# EAGLE design rpi-can-rs485 (EAGLE 6.2)
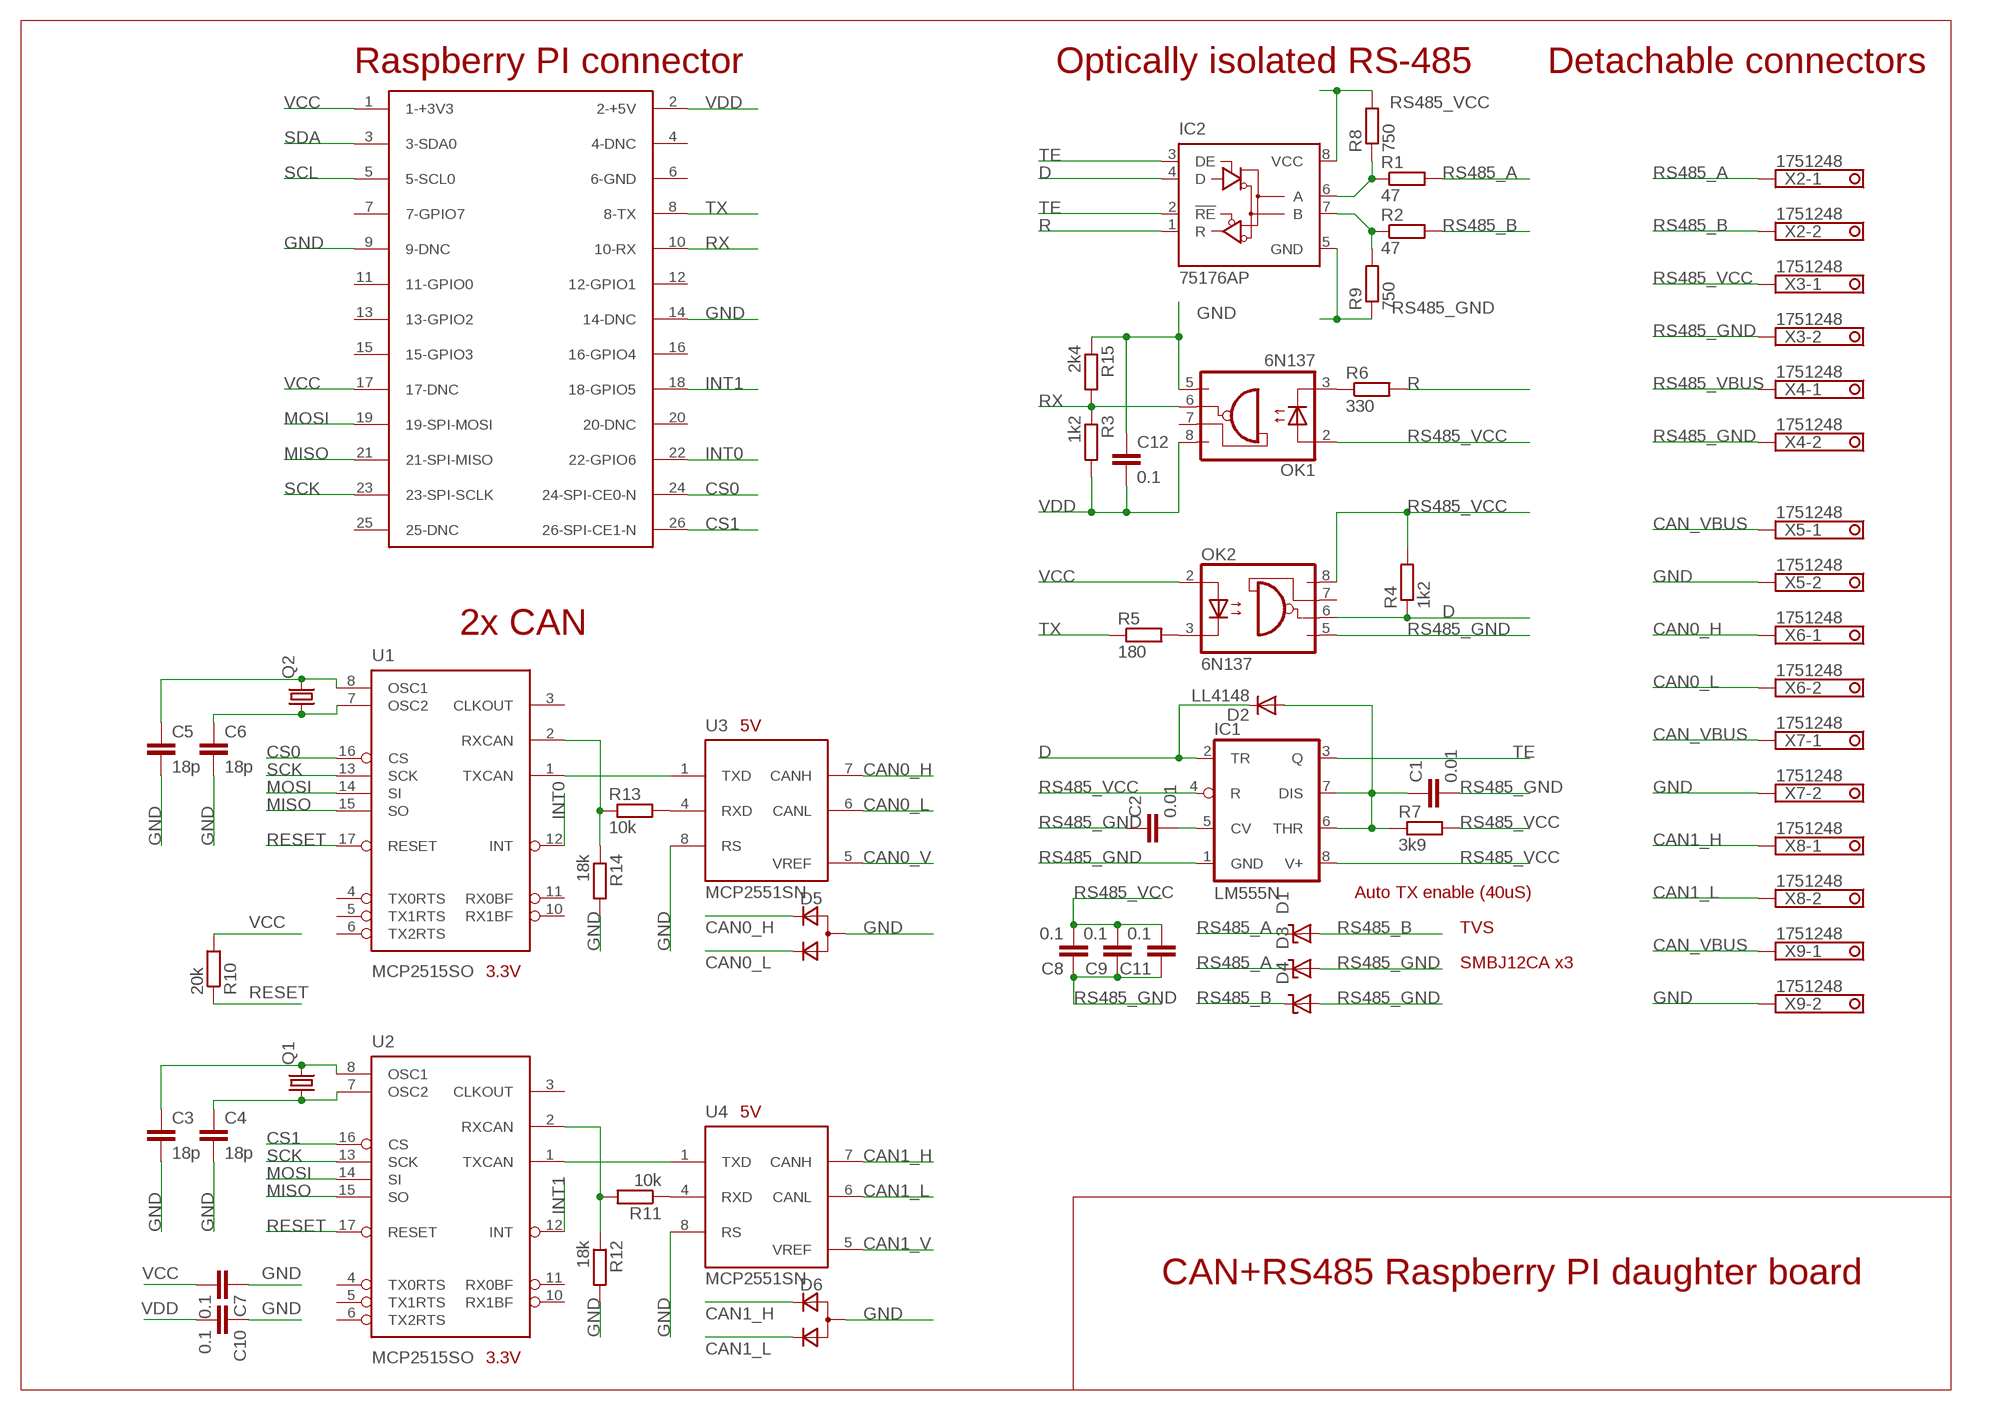
[diagram p0: schematic, sheet 1]

## Parts
C1  0.01  C-EUC0805  [C0805]
C2  0.01  C-EUC0805  [C0805]
C3  18p  C-EUC0805  [C0805]
C4  18p  C-EUC0805  [C0805]
C5  18p  C-EUC0805  [C0805]
C6  18p  C-EUC0805  [C0805]
C7  0.1  C-EUC1206  [C1206]
C8  0.1  C-EUC0805  [C0805]
C9  0.1  C-EUC0805  [C0805]
C10  0.1  C-EUC0805  [C0805]
C11  0.1  C-EUC1206  [C1206]
C12  0.1  C-EUC1206  [C1206]
D1  SUPPRESSOR-SMBJ  [SMBJ]
D2  LL4148  DIODE-SOD80C  [SOD80C]
D3  SUPPRESSOR-SMBJ  [SMBJ]
D4  SUPPRESSOR-SMBJ  [SMBJ]
D5  D_2CSOT323  [SOT323]
D6  D_2CSOT323  [SOT323]
IC1  LM555N  [DIL08]
IC2  75176AP  [DIL08]
OK1  6N137  [DIL08]
OK2  6N137  [DIL08]
Q1  CRYSTALHC49S  [HC49/S]
Q2  CRYSTALHC49S  [HC49/S]
R1  47  R-EU_R1206  [R1206]
R2  47  R-EU_R1206  [R1206]
R3  1k2  R-EU_R0805  [R0805]
R4  1k2  R-EU_R0805  [R0805]
R5  180  R-EU_R0805  [R0805]
R6  330  R-EU_R0805  [R0805]
R7  3k9  R-EU_R0805  [R0805]
R8  750  R-EU_R1206  [R1206]
R9  750  R-EU_R1206  [R1206]
R10  20k  R-EU_R0805  [R0805]
R11  10k  R-EU_R0805  [R0805]
R12  18k  R-EU_R0805  [R0805]
R13  10k  R-EU_R0805  [R0805]
R14  18k  R-EU_R0805  [R0805]
R15  2k4  R-EU_R0805  [R0805]
U1  MCP2515SO  MCP2510SO  [SO-18W]
U2  MCP2515SO  MCP2510SO  [SO-18W]
U3  MCP2551SN  [SO-08]
U4  MCP2551SN  [SO-08]
U$1  RASPBERRY-PI  [RASPBERRY-PI]
X2  1751248  [1751248]
X3  1751248  [1751248]
X4  1751248  [1751248]
X5  1751248  [1751248]
X6  1751248  [1751248]
X7  1751248  [1751248]
X8  1751248  [1751248]
X9  1751248  [1751248]

## Nets
CAN0_H: D5.2(C1) U3.7(CANH) X6.1
CAN0_L: D5.3(C2) U3.6(CANL) X6.2
CAN0_TX: U1.1(TXCAN) U3.1(TXD)
CAN0_V: U3.5(VREF)
CAN1_H: D6.2(C1) U4.7(CANH) X8.1
CAN1_L: D6.3(C2) U4.6(CANL) X8.2
CAN1_TX: U2.1(TXCAN) U4.1(TXD)
CAN1_V: U4.5(VREF)
CAN_VBUS: X5.1 X7.1 X9.1
CS0: U1.16(CS) U$1.24(24-SPI-CE0-N)
CS1: U2.16(CS) U$1.26(26-SPI-CE1-N)
D: D2.C IC1.2(TR) IC2.4(D) OK2.6(VO) R4.1
GND: C3.2 C4.2 C5.2 C6.2 C7.1 C10.1 C12.1 D5.1(A) D6.1(A) OK1.5(GND) R12.2 R14.2 R15.1 U3.8(RS) U4.8(RS) U$1.9(9-DNC) U$1.14(14-DNC) X5.2 X7.2 X9.2
INT0: U1.12(INT) U$1.22(22-GPIO6)
INT1: U2.12(INT) U$1.18(18-GPIO5)
MISO: U1.15(SO) U2.15(SO) U$1.21(21-SPI-MISO)
MOSI: U1.14(SI) U2.14(SI) U$1.19(19-SPI-MOSI)
N$1: C6.1 Q2.1 U1.7(OSC2)
N$2: C1.1 D2.A IC1.6(THR) IC1.7(DIS) R7.1
N$3: IC2.7(B) R2.1 R9.2
N$4: IC2.6(A) R1.1 R8.1
N$5: C2.2 IC1.5(CV)
N$6: C5.1 Q2.2 U1.8(OSC1)
N$7: OK2.3(C) R5.2
N$8: OK1.3(C) R6.1
N$9: R11.1 U4.4(RXD)
N$10: R13.2 U3.4(RXD)
N$11: C3.1 Q1.2 U2.8(OSC1)
N$12: C4.1 Q1.1 U2.7(OSC2)
N$13: R13.1 R14.1 U1.2(RXCAN)
N$14: R11.2 R12.1 U2.2(RXCAN)
R: IC2.1(R) R6.2
RESET: R10.1 U1.17(RESET) U2.17(RESET)
RS485_A: D1.C D3.C R1.2 X2.1
RS485_B: D1.A D4.C R2.2 X2.2
RS485_GND: C1.2 C2.1 C8.1 C9.1 C11.1 D3.A D4.A IC1.1(GND) IC2.5(GND) OK2.5(GND) R9.1 X3.2 X4.2
RS485_VBUS: X4.1
RS485_VCC: C8.2 C9.2 C11.2 IC1.4(R) IC1.8(V+) IC2.8(VCC) OK1.2(A) OK2.8(VCC) R4.2 R7.2 R8.2 X3.1
RX: OK1.6(VO) R3.1 R15.2 U$1.10(10-RX)
SCK: U1.13(SCK) U2.13(SCK) U$1.23(23-SPI-SCLK)
SCL: U$1.5(5-SCL0)
SDA: U$1.3(3-SDA0)
TE: IC1.3(Q) IC2.2(!RE) IC2.3(DE)
TX: R5.1 U$1.8(8-TX)
VCC: C7.2 OK2.2(A) R10.2 U$1.1(1-+3V3) U$1.17(17-DNC)
VDD: C10.2 C12.2 OK1.8(VCC) R3.2 U$1.2(2-+5V)
Unconnected: OK1.7(VE) OK2.7(VE) U1.3(CLKOUT) U1.4(TX0RTS) U1.5(TX1RTS) U1.6(TX2RTS) U1.10(RX1BF) U1.11(RX0BF) U2.3(CLKOUT) U2.4(TX0RTS) U2.5(TX1RTS) U2.6(TX2RTS) U2.10(RX1BF) U2.11(RX0BF) U$1.4(4-DNC) U$1.6(6-GND) U$1.7(7-GPIO7) U$1.11(11-GPIO0) U$1.12(12-GPIO1) U$1.13(13-GPIO2) U$1.15(15-GPIO3) U$1.16(16-GPIO4) U$1.20(20-DNC) U$1.25(25-DNC)

## Notes on the sheet
- Raspberry PI connector | Optically isolated RS-485 | Detachable connectors
- 2x CAN
- 5V
- Auto TX enable (40uS)
- TVS
- SMBJ12CA x3
- 3.3V
- 5V
- CAN+RS485 Raspberry PI daughter board
- 3.3V

## Power pins joined to a net without a drawn wire
GND: U1.9(VSS) U2.9(VSS) U3.2(VSS) U4.2(VSS)
VCC: U1.18(VDD) U2.18(VDD)
VDD: U3.3(VDD) U4.3(VDD)

## Library data of the parts
C1-C12 = rcl:C-EU: CAPACITOR, European symbol
D1 D3 D4 = diode:SUPPRESSOR-: Suppressor diode
D2 = diode:DIODE-: DIODE
D5 D6 = zetex:D_2C: Dual DIODE; OC_FARNELL: unknown; OC_NEWARK: unknown
IC1 = linear:*555: TIMER
IC2 = 751xx:75176A: DIFFERENTIAL BUS TRANSCEIVER Source: http://focus.ti.com/lit/ds/symlink/sn75176a.pdf
OK1 OK2 = optocoupler:6N137: MOTOROLA OPTO COUPLER; MPN: 6N137; OC_FARNELL: 1328376; OC_NEWARK: 52M1895
Q1 Q2 = crystal:CRYSTAL: CRYSTAL; OC_FARNELL: 1667008; OC_NEWARK: unknown
R1-R15 = rcl:R-EU_: RESISTOR, European symbol
U1 U2 = my-microchip-can:MCP2510
U3 U4 = my-microchip-can:MCP2551: High Speed CAN tranceiver
U$1 = RaspberryPi:RASPBERRY-PI: Raspberry Pi Board <http://www.raspberrypi.org/> Jacques Lagnel V1.0 (beta) 2012 Board dimension: Forum 3D model <http://www.raspberrypi.org/forum/general-discussion/mechanical-profile-3d-models?value=3d%20model&type=1&include=1&search=1&ret=all> The GPIO Connector (P1): http://elinux.org/RPi_Low-level_peripherals
X2-X9 = con-phoenix-350:1751248: MKDS 1/ 2-3,5 Printklemme Nennstrom: 10 A Bemessungsspannung: 160 V Raster: 3,5 mm Polzahl: 2 Montageart: Löten Anschlussart: Schraubanschluss Anschlussrichtung vom Leiter zur Platine: 0° Source: http://eshop.phoenixcontact.com .. 1751248.pdf; OC_FARNELL: unknown; OC_NEWARK: unknown

## Board
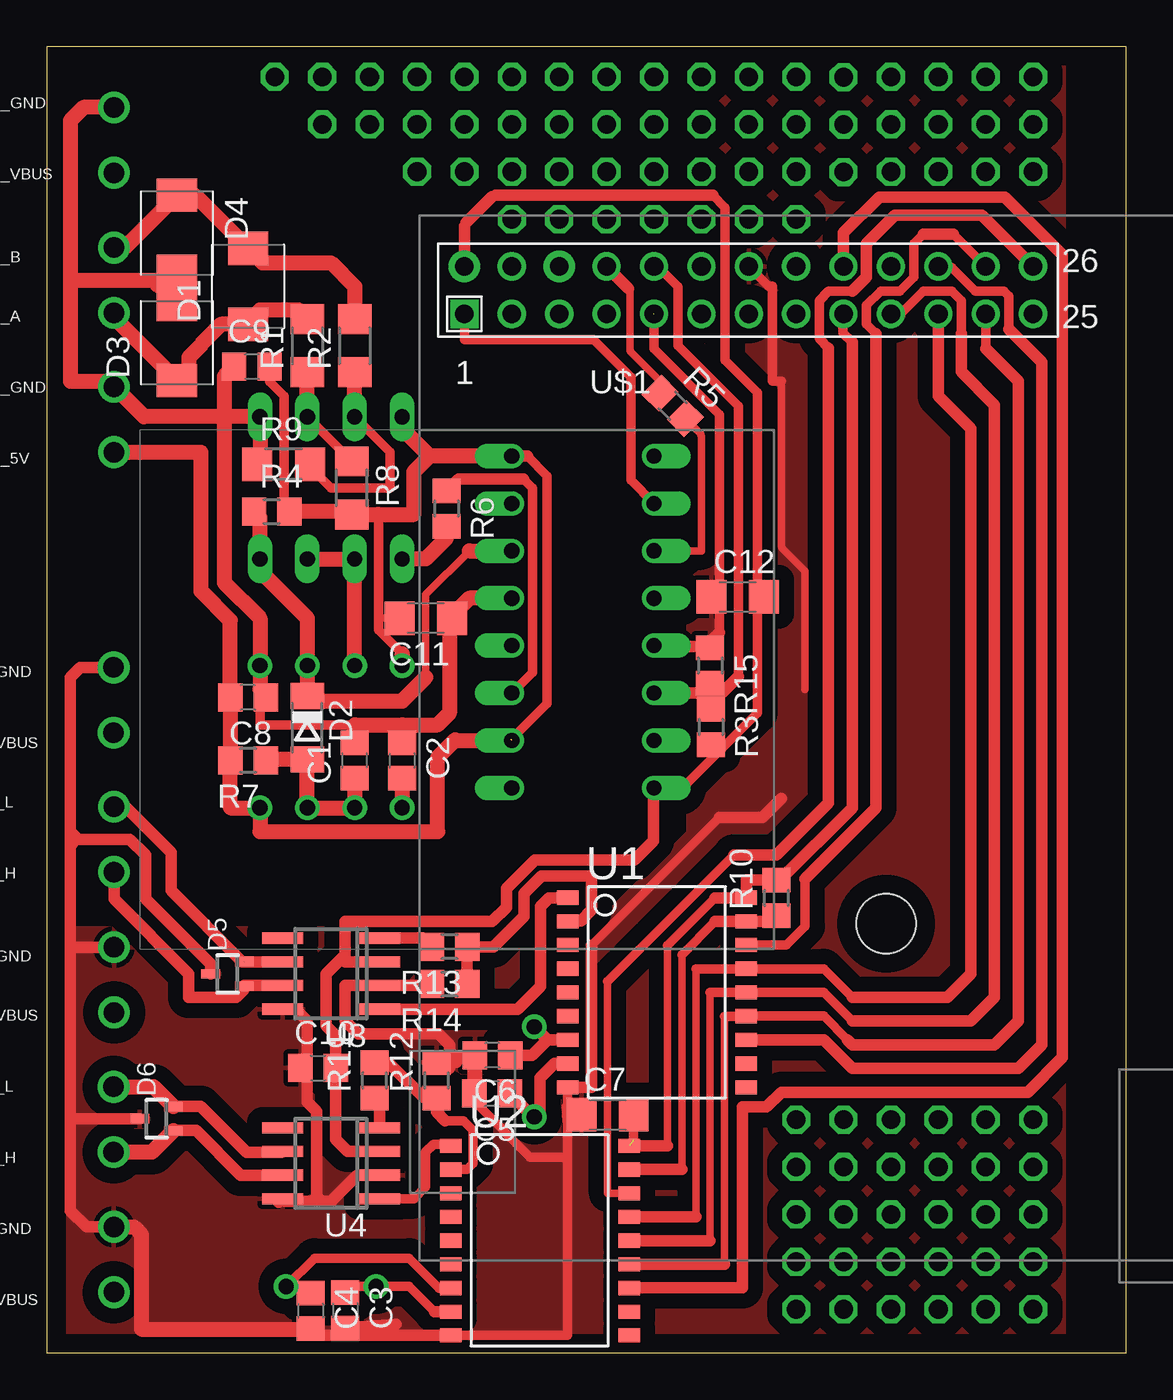
[diagram p1: board, top side]
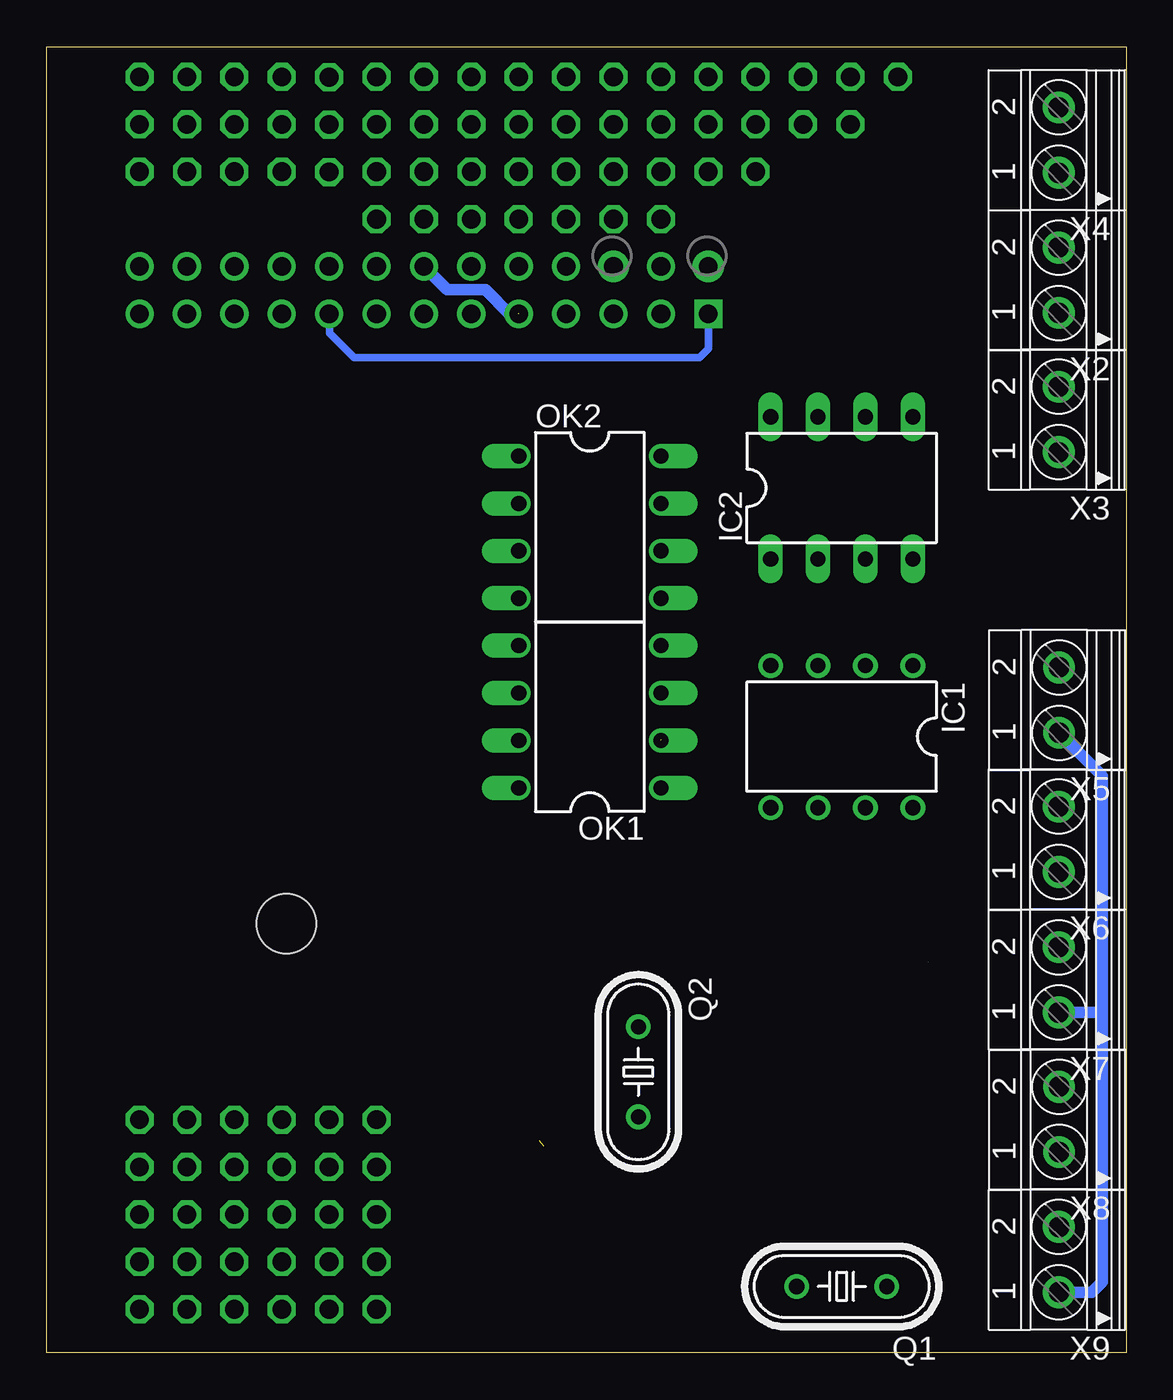
[diagram p2: board, bottom side, seen from below]

Size 57.85 x 70 mm. Coordinates in mm from the lower left corner, seen from the top.
Outline: 0,0 57.85,0 57.85,70 0,70 0,0
Copper layers (1*16): Top 0.035mm / dielectric 1.5mm / Bottom 0.035mm
Design rules: minimum track width 10mil, minimum drill 24mil, track to track 8mil, track to pad 8mil, pad to pad 8mil, via to via 8mil, smd to smd 8mil, copper to edge 40mil, drill to drill 8mil, minimum pad ring 10mil, minimum via ring 8mil, stop-mask expansion 4mil, vias tented up to drill 0mil, thermal gap 10mil
Holes 3.2 mm at 45,23

### Footprints (pad centres in the part's own frame; a part is rotated, then mirrored left to right if it is on the bottom)
C0805 = smd 1.3 x 1.5: 1 -0.95,0; 2 0.95,0
C1206 = smd 1.6 x 1.8: 1 -1.4,0; 2 1.4,0
SMBJ = smd 1.78 x 2.16: A 2.04,0; C -2.03,0
SOD80C = smd 1.4 x 1.8: A 1.7,0; C -1.7,0
SOT323 = smd 0.5 x 1: 1 0,0.9; 2 -0.65,-0.9; 3 0.65,-0.9
DIL08 = drill 0.813 pad 1.27: 1 -3.81,-3.81; 2 -1.27,-3.81; 3 1.27,-3.81; 4 3.81,-3.81; 5 3.81,3.81; 6 1.27,3.81; 7 -1.27,3.81; 8 -3.81,3.81
DIL08' = drill 0.813 long: 1 -3.81,-3.81; 2 -1.27,-3.81; 3 1.27,-3.81; 4 3.81,-3.81; 5 3.81,3.81; 6 1.27,3.81; 7 -1.27,3.81; 8 -3.81,3.81
DIL08'' = drill 0.813 offset: 1 -3.81,-3.81; 2 -1.27,-3.81; 3 1.27,-3.81; 4 3.81,-3.81; 5 3.81,3.81; 6 1.27,3.81; 7 -1.27,3.81; 8 -3.81,3.81
HC49/S = drill 0.813: 1 -2.413,0; 2 2.413,0
R1206 = smd 1.6 x 1.803: 1 -1.422,0; 2 1.422,0
R0805 = smd 1.3 x 1.5: 1 -0.95,0; 2 0.95,0
SO-18W = smd 0.762 x 1.143: 1 -5.08,-4.788; 2 -3.81,-4.788; 3 -2.54,-4.788; 4 -1.27,-4.788; 5 0,-4.788; 6 1.27,-4.788; 7 2.54,-4.788; 8 3.81,-4.788; 9 5.08,-4.788; 10 5.08,4.788; 11 3.81,4.788; 12 2.54,4.788; 13 1.27,4.788; 14 0,4.788; 15 -1.27,4.788; 16 -2.54,4.788; 17 -3.81,4.788; 18 -5.08,4.788
SO-08 = smd 0.6 x 2.2: 1 -1.905,-2.6; 2 -0.635,-2.6; 3 0.635,-2.6; 4 1.905,-2.6; 5 1.905,2.6; 6 0.635,2.6; 7 -0.635,2.6; 8 -1.905,2.6
RASPBERRY-PI = drill 1 square: 1 0,0 | drill 1 pad 1.676: 2 0,2.54; 6 5.08,2.54 | drill 1: 3 2.54,0; 4 2.54,2.54; 5 5.08,0; 7 7.62,0; 8 7.62,2.54; 9 10.16,0; 10 10.16,2.54; 11 12.7,0; 12 12.7,2.54; 13 15.24,0; 14 15.24,2.54; 15 17.78,0; 16 17.78,2.54; 17 20.32,0; 18 20.32,2.54; 19 22.86,0; 20 22.86,2.54; 21 25.4,0; 22 25.4,2.54; 23 27.94,0; 24 27.94,2.54; 25 30.48,0; 26 30.48,2.54
1751248 = drill 1.1 pad 1.7: 1 -1.75,-0.1; 2 1.75,-0.1

### Placement (x,y rotation side)
C1  16.51,31.75 90 top
C2  19.05,31.75 270 top
C3  16,2.29 270 top
C4  14.15,2.26 270 top
C5  23.88,13.89 180 top
C6  23.9,15.95 180 top
C7  30.06,12.76 0 top
C8  10.79,35.13 180 top
C9  11,52.86 0 top
C10  14.55,15.27 0 top
C11  20.32,39.37 180 top
C12  37.03,40.51 0 top
D1  10.79,57.15 90 top
D2  13.97,33.5 270 top
D3  6.99,54.13 90 top
D4  6.99,60.01 270 top
D5  9.69,20.31 90 top
D6  5.89,12.55 90 top
IC1  15.24,33.02 180 bottom
IC2  75176AP  [DIL08']  15.24,46.35 0 bottom
OK1  6N137  [DIL08'']  28.74,34.09 90 bottom
OK2  6N137  [DIL08'']  28.74,44.25 270 bottom
Q1  15.24,3.56 180 bottom
Q2  26.14,15.06 270 bottom
R1  13.97,53.98 90 top
R2  16.51,53.98 90 top
R3  35.6,33.54 270 top
R4  12.06,45.09 0 top
R5  33.55,50.75 315 top
R6  21.43,45.24 270 top
R7  10.79,31.75 180 top
R8  16.35,46.35 270 top
R9  12.7,47.62 0 top
R10  39.12,24.38 90 top
R11  17.58,14.61 90 top
R12  20.9,14.61 90 top
R13  21.59,21.77 180 top
R14  21.59,19.76 180 top
R15  35.56,36.83 270 top
U1  32.71,19.32 270 top
U2  26.44,6.01 270 top
U3  15.24,20.32 90 top
U4  15.24,10.16 90 top
U$1  22.39,55.68 0 top
X2  3.71,57.48 90 bottom
X3  3.71,50.02 90 bottom
X4  3.71,64.99 90 bottom
X5  3.69,34.98 90 bottom
X6  3.71,27.52 90 bottom
X7  3.71,19.99 90 bottom
X8  3.69,12.51 90 bottom
X9  3.7,5 90 bottom

### Tracks (layer width: path | path; a pad name or v marks a point on that pad's centre or on a via)
CAN0_H
  Top 0.61: U3.7 10.59,19.68 D5.2 10.59,19.48 10.16,19.05 7.62,19.05 7.62,20.32 3.61,24.33 X6.1
CAN0_L  (1 unrouted)
  Top 0.61: D5.3 U3.6 | X6.2 3.64,29.3 4.18,29.3 6.67,26.81 6.67,24.78 10.49,20.96 D5.3
CAN0_TX
  Top 0.61: U1.1 27.91,24.38 26.92,24.38 26.47,23.93 26.47,19.63 25.25,18.41 U3.1
CAN1_H
  Top 0.61: U4.7 10.39,9.53 8,11.91 6.81,11.91 D6.2
  Top 0.813: X8.1 5.66,10.76 D6.2
CAN1_L
  Top 0.61: D6.3 8.27,13.2 10.72,10.74 12.59,10.74 U4.6
  Top 0.813: X8.2 5.73,14.26 D6.3
CAN1_TX
  Top 0.508: U4.1 19.68,8.26 20.32,8.89 20.32,10.76 20.74,11.18 21.59,11.18 21.65,11.11 U2.1
CAN_VBUS
  Bottom 0.61: X9.1 1.83,3.25 1.27,3.81 1.27,18.34 | 1.27,18.34 1.27,30.91 X5.1 | X7.1 1.37,18.24 1.27,18.34
CS0
  Top 0.508: U1.16 39.63,21.86 40.64,22.86 40.64,25.4 | 48.61,59.94 U$1.24 | 46.99,59.94 46.48,59.44 46.48,57.66 45.72,56.9 44.7,56.9 43.94,56.13 43.94,55.12 44.45,54.61
  Top 0.61: 46.99,59.94 48.61,59.94 | 44.45,54.61 44.45,29.21 40.64,25.4
CS1
  Top 0.406: 31.5,8.55 30.06,8.55 30.06,19.9
  Top 0.508: 43.18,56.9 41.91,56.9 41.4,56.39 41.4,54.36 41.91,53.85 | U2.16 31.5,8.55 | 30.06,19.9 36.83,26.67
  Top 0.61: U$1.26 50.13,60.96 45.47,60.96 43.94,59.44 43.94,57.66 43.18,56.9 | 36.83,26.67 39.12,26.67 41.91,29.46 41.91,53.85
D
  Top 0.406: 20.32,36.2 20.32,40.64 22.66,42.98
  Top 0.813: 20.32,36.2 19.05,34.92 14.18,34.92 D2.C IC1.2 13.97,39.37 11.43,41.91 IC2.4 11.43,44.77 R4.1 | 22.66,42.98 OK2.6
GND  (1 unrouted)
  Top 0.406: R15.1 35.56,38.1 | 39.37,52.07 39.37,43.28 arc45 39.44,43.11 40.64,41.91 40.64,35.56 | 36.07,38.61 36.07,40.03 arc45 35.99,40.21 35.56,40.64
  Top 0.508: U2.9 27.92,0.94 27.92,10.49 | 27.92,10.49 27.92,12.7 27.92,13.21 U1.9 | 36.07,28.7 29.21,21.84 | C10.1 13.95,15.27 13.97,15.24 | 39.37,52.07 38.9,52.07 38.9,57.16 38.69,57.16 U$1.14 | 36.07,38.61 36.07,50.29 32.55,53.81 U$1.9 | C5.2 22.93,13.47 25.91,10.49 27.92,10.49
  Top 0.61: 36.07,38.61 35.56,38.1 35.31,37.85 32.6,37.85 OK1.5 | 39.37,29.72 38.35,28.7 36.07,28.7 | U1.9 27.93,14.22 29.21,14.22 29.21,21.84 | 18.73,1.52 C3.2 18.94,0.94 | C7.1 27.92,12.7 | 27.95,12.42 27.92,13.21 | U4.2 16.64,9.53 15.24,8.13 14.73,8.13 14.48,8.38 | 12.45,8.06 U4.8 12.77,8.13 14.22,8.13 14.48,8.38 | U3.8 13.34,18.41 13.97,17.78 13.97,15.24 13.97,13.46 14.48,12.95 14.48,8.38 | 18.94,0.94 14.37,0.94 C4.2 | 18.94,0.94 U2.9 | X9.2 2.14,6.75 1.27,7.62 1.27,12.42 | 1.27,12.42 1.27,21.59 | 1.27,21.59 1.27,27.18 | 1.27,27.18 1.27,27.94 | 1.27,27.94 1.27,36.2 1.8,36.73 X5.2 | 1.4,27.3 1.27,27.18 | X7.2 1.42,21.74 1.27,21.59 | D6.1 1.4,12.55 1.27,12.42 | 21.98,15.95 C6.2 21.59,15.95 21.59,15.24 | R14.2 20.56,19.68 U3.2 16,19.68 16,17.78 16.7,17.08 21.02,17.08 21.59,16.51 21.59,15.56 21.59,15.55 R12.2 21.98,15.55 | 1.27,27.94 1.69,27.52 4.46,27.52 5.31,26.67 5.31,24.32 8.79,20.84 D5.1
  Top 0.813: X9.2 4.68,6.75 5.08,6.35 5.08,1.27 14.15,1.27 C4.2 | C5.2 22.95,13.89 C6.2
  Bottom 0.61: 32.54,55.68 33.05,55.68 34.34,56.97 36.38,56.97 U$1.14
  pour Top (isolate 0.813): 0,0 54.61,0 54.61,69.85 34.29,69.85 34.29,29.21 34.29,27.94 29.21,22.86 0,22.86
INT0
  Top 0.508: 51.56,54.86 51.56,56.64 51.31,56.9 49.78,56.9 48.51,58.17 47.84,58.17
  Top 0.61: U1.12 41.65,16.77 43.18,15.24 52.07,15.24 53.34,16.51 53.34,53.09 51.56,54.86 | 47.84,58.17 U$1.22
INT1
  Top 0.61: U2.12 37.29,3.48 37.29,13.17 38.57,13.17 39.37,13.97 52.59,13.97 54.45,15.82 54.45,58.85 51.36,61.94 44.63,61.94 42.71,60.02 U$1.18
MISO
  Top 0.406: 34.8,20.57 34.8,7.29
  Top 0.508: 34.8,20.57 37.5,20.57 U1.15 41.65,20.59 43.18,19.05
  Top 0.61: 34.8,7.29 U2.15 | 43.18,19.05 48.26,19.05 49.53,20.32 49.53,49.53 47.79,51.27 U$1.21
MOSI
  Top 0.406: 35.56,19.3 35.56,6.01
  Top 0.508: 35.56,19.3 37.5,19.3 U1.14 41.65,19.32 43.18,17.78 | 49.02,54.61 49.02,56.39 48.51,56.9 46.99,56.9 45.72,55.63
  Top 0.61: 45.72,55.63 45.3,55.63 U$1.19 | 35.56,6.01 U2.14 | 49.02,54.61 49.02,52.58 50.8,50.8 50.8,19.05 49.53,17.78 43.18,17.78
N$1
  Top 0.61: U1.7 26.84,16.77 | 26.84,16.77 Q2.1 | C6.1 26.01,15.95 26.84,16.77
N$2
  Top 0.813: C1.1 IC1.6 IC1.7 D2.A 11.79,31.8 R7.1
N$3
  Top 0.508: 14.12,47.47 15.24,46.35 18.41,46.35 18.41,48.26 IC2.7
  Top 0.813: R9.2 14.12,47.47 | IC2.7 R2.1
N$4
  Top 0.508: R8.1 IC2.6
  Top 0.813: R8.1 | IC2.6 R1.1
N$5
  Top 0.813: C2.2 IC1.5
N$6
  Top 0.61: 25.13,13.73 C5.1 26.07,12.65 Q2.2 26.44,12.95 26.44,14.73 27.21,15.51 U1.8
N$7
  Top 0.406: OK2.3 35.08,42.98 35.08,49.11 arc45 35.01,49.29 R5.2
N$8
  Top 0.508: 25.56,46.83 26.04,46.35 26.04,36.46 OK1.3
  Top 0.61: 25.56,46.83 22.07,46.83 R6.1
N$9
  Top 0.61: U4.4 17.84,13.39 R11.1
N$10
  Top 0.61: U3.4 20.18,22.23 R13.2
N$11
  Top 0.508: 20.78,2.21 19.43,3.56 Q1.2 16.32,3.56 C3.1
  Top 0.61: U2.8 20.78,2.21
N$12
  Top 0.508: Q1.1 14.35,5.08 19.43,5.08 21.04,3.47 U2.7 | 12.76,3.49 Q1.1 | Q1.1 13.8,3.56 C4.1
N$13
  Top 0.61: R14.1 R13.1 23.95,21.77 25.58,23.39 25.58,24.61 26.52,25.55 29.06,25.55 29.21,25.4 29.21,23.72 28.63,23.14 27.94,23.14 U1.2
N$14
  Top 0.508: U2.2 22.52,9.82 22.86,10.16 22.86,11.91 22.35,12.42 21.39,12.42 21.36,12.45
  Top 0.61: 21.36,12.45 20.9,12.9 R12.1 20.23,13.65 18.34,15.54 R11.2
N$15  (via drill 1)
  other vias: 27.47,68.38
N$16  (via drill 1)
  other vias: 27.47,60.76
N$17  (via drill 1)
  other vias: 35.09,68.38
N$18  (via drill 1)
  other vias: 35.09,63.3
N$19  (via drill 1)
  other vias: 37.63,68.38
N$21  (via drill 1)
  other vias: 37.63,63.3
N$22  (via drill 1)
  other vias: 35.09,60.76
N$23  (via drill 1)
  other vias: 37.63,65.84
N$24  (via drill 1)
  other vias: 40.17,60.76
N$25  (via drill 1)
  other vias: 40.17,68.38
N$26  (via drill 1)
  other vias: 40.17,63.3
N$27  (via drill 1)
  other vias: 42.71,65.82
N$28  (via drill 1)
  other vias: 40.17,65.84
N$29  (via drill 1)
  other vias: 42.71,68.36
N$30  (via drill 1)
  other vias: 42.71,63.28
N$31  (via drill 1)
  other vias: 52.87,68.38
N$32  (via drill 1)
  other vias: 45.25,63.3
N$33  (via drill 1)
  other vias: 47.79,65.84
N$34  (via drill 1)
  other vias: 50.33,65.84
N$35  (via drill 1)
  other vias: 37.63,60.76
N$36  (via drill 1)
  other vias: 40.17,4.88
N$37  (via drill 1)
  other vias: 52.87,65.84
N$38  (via drill 1)
  other vias: 47.79,63.3
N$39  (via drill 1)
  other vias: 50.33,63.3
N$40  (via drill 1)
  other vias: 45.25,65.84
N$41  (via drill 1)
  other vias: 45.25,68.38
N$42  (via drill 1)
  other vias: 47.79,68.38
N$43  (via drill 1)
  other vias: 50.33,68.38
N$44  (via drill 1)
  other vias: 52.87,63.3
N$45  (via drill 1)
  other vias: 30.01,68.38
N$46  (via drill 1)
  other vias: 32.55,68.38
N$47  (via drill 1)
  other vias: 35.09,65.84
N$48  (via drill 1)
  other vias: 32.55,63.3
N$49  (via drill 1)
  other vias: 22.39,63.3
N$50  (via drill 1)
  other vias: 19.85,63.3
N$51  (via drill 1)
  other vias: 24.93,63.3
N$52  (via drill 1)
  other vias: 27.47,63.3
N$53  (via drill 1)
  other vias: 24.93,60.76
N$54  (via drill 1)
  other vias: 32.55,60.76
N$55  (via drill 1)
  other vias: 30.01,60.76
N$56  (via drill 1)
  other vias: 30.01,63.3
N$57  (via drill 1)
  other vias: 32.55,65.84
N$58  (via drill 1)
  other vias: 30.01,65.84
N$59  (via drill 1)
  other vias: 17.31,65.84
N$60  (via drill 1)
  other vias: 27.47,65.84
N$61  (via drill 1)
  other vias: 24.93,65.84
N$62  (via drill 1)
  other vias: 22.39,65.84
N$63  (via drill 1)
  other vias: 19.85,65.84
N$64  (via drill 1)
  other vias: 14.77,65.84
N$65  (via drill 1)
  other vias: 14.77,68.38
N$66  (via drill 1)
  other vias: 17.31,68.38
N$67  (via drill 1)
  other vias: 19.85,68.38
N$68  (via drill 1)
  other vias: 22.39,68.38
N$69  (via drill 1)
  other vias: 24.93,68.38
N$70  (via drill 1)
  other vias: 12.23,68.38
N$71  (via drill 1)
  other vias: 40.17,7.42
N$72  (via drill 1)
  other vias: 40.17,9.96
N$73  (via drill 1)
  other vias: 40.17,12.5
N$74  (via drill 1)
  other vias: 42.71,12.5
N$75  (via drill 1)
  other vias: 45.25,7.42
N$76  (via drill 1)
  other vias: 47.79,9.96
N$77  (via drill 1)
  other vias: 50.33,7.42
N$78  (via drill 1)
  other vias: 52.87,12.5
N$79  (via drill 1)
  other vias: 52.87,9.96
N$80  (via drill 1)
  other vias: 52.87,7.42
N$81  (via drill 1)
  other vias: 52.87,4.88
N$82  (via drill 1)
  other vias: 52.87,2.34
N$83  (via drill 1)
  other vias: 50.33,2.34
N$84  (via drill 1)
  other vias: 47.79,2.34 47.79,2.34
N$85  (via drill 1)
  other vias: 45.25,2.34
N$86  (via drill 1)
  other vias: 40.17,2.34
N$87  (via drill 1)
  other vias: 42.71,4.88
N$88  (via drill 1)
  other vias: 42.71,7.42
N$89  (via drill 1)
  other vias: 42.71,9.96
N$90  (via drill 1)
  other vias: 45.25,12.5
N$91  (via drill 1)
  other vias: 47.79,12.5
N$92  (via drill 1)
  other vias: 50.33,12.5
N$93  (via drill 1)
  other vias: 50.33,9.96
N$94  (via drill 1)
  other vias: 50.33,4.88
N$95  (via drill 1)
  other vias: 47.79,4.88
N$96  (via drill 1)
  other vias: 47.79,7.42
N$97  (via drill 1)
  other vias: 45.25,9.96
N$98  (via drill 1)
  other vias: 45.25,4.88
N$100  (via drill 1)
  other vias: 42.71,2.34
R
  Top 0.813: R6.2 21.43,43.66 20.32,42.55 IC2.1
RESET
  Top 0.406: 34.04,21.34 34.04,9.82
  Top 0.508: 34.04,21.34 35.83,23.12
  Top 0.61: R10.1 38.81,23.12 U1.17 35.83,23.12 | 34.04,9.82 U2.17
RS485_A
  Top 0.813: R1.2 13.49,55.88 11.43,55.88 10.79,55.24 D1.C 9.35,55.12 8.26,54.03 8.26,53.98 7.62,53.34 7.62,52.74 D3.C 3.61,55.48 X2.1
RS485_B
  Top 0.813: R2.2 16.51,57.15 15.24,58.42 11.56,58.42 D1.A 7.95,62.04 D4.C 4.18,59.23 X2.2
RS485_GND
  Top 0.406: 21.59,39.37 C11.1
  Top 0.508: 11.43,35.56 11.43,33.66 16.51,33.66
  Top 0.813: 19.05,33.66 16.51,33.66 C1.2 | 19.05,33.66 20.95,33.66 21.59,34.29 21.59,39.37 22.66,40.44 OK2.5 | C2.1 19.05,33.66 | 9.53,50.16 IC2.5 11.43,47.78 R9.1 | D4.A D3.A 6.99,56.52 6.35,57.15 6.03,57.15 5.87,57.31 6.03,57.47 1.27,57.47 | 1.27,57.47 1.27,52.07 3.31,52.07 X3.2 5.21,50.16 9.53,50.16 | X4.2 1.97,66.74 1.27,66.04 1.27,57.47 | C8.1 11.74,35.24 11.43,35.56 IC1.1 11.43,39.37 9.53,41.27 9.53,50.16 | C9.1 9.53,52.33 9.53,50.16
RS485_VCC  (1 unrouted)
  Top 0.406: C11.2 17.78,39.37
  Top 0.508: 19.05,37.47 17.78,38.73 17.78,39.37 17.78,44.93 | 24.89,32.86 26.83,34.8 26.83,46.99 25.76,48.06 | C9.2 11.95,52.06 12.72,51.28 12.72,45.38 R4.2
  Top 0.61: 25.76,48.06 OK2.8
  Top 0.813: OK2.8 20.52,48.06 | 20.52,48.06 19.05,49.53 IC2.8 | IC1.4 19.05,37.47 | 20.52,48.06 19.68,47.22 19.68,44.93 17.78,44.93 R8.2 16.2,45.09 R4.2 | X3.1 8.26,48.26 8.28,48.23 8.28,40.82 9.85,39.25 C8.2 R7.2 9.85,29.21 IC1.8 11.43,27.94 20.95,27.94 20.95,31.91 21.91,32.86 21.95,32.82 OK1.2
RX
  Top 0.406: R15.2 35.56,35.36
  Top 0.508: 37.08,36.25 37.08,50.74 33.83,53.99 33.83,57.14 32.75,58.22 U$1.10 | R3.1 35.6,35.32 35.56,35.36
  Top 0.61: OK1.6 35.56,35.36 36.2,35.36 37.08,36.25
SCK
  Top 0.406: 36.32,18.03 36.32,4.75
  Top 0.508: 36.32,18.03 37.5,18.03 U1.13 41.65,18.05 42.93,16.76 | U$1.23 50.33,53.81
  Top 0.61: 36.32,4.75 U2.13 | 50.33,53.81 52.07,52.07 52.07,17.78 50.8,16.51 43.18,16.51 42.93,16.76
TE
  Top 0.813: IC2.3 IC2.2 IC1.3
TX
  Top 0.406: 31.19,57.04 arc-45 31.27,56.86 31.27,53.79 arc45 31.34,53.61 32.96,51.99 32.96,51.6 arc-45 R5.1 | R5.1
  Top 0.61: U$1.8 31.19,57.04
VCC  (1 unrouted)
  Top 0.406: 33.27,21.84 33.27,11.1
  Top 0.508: 33.27,21.84 35.81,24.38 | 43.18,54.15 42.69,54.65 42.69,55.66 | OK2.2 31.3,46.76 31.3,52.29 29.3,54.29 22.39,54.29 U$1.1 | C7.2 31.46,11.38
  Top 0.61: 35.81,24.38 37.49,24.38 U1.18 37.5,25.33 R10.2 39.3,25.33 43.18,29.21 43.18,54.15 | 33.27,11.1 U2.18 | 42.69,55.66 U$1.17
  Bottom 0.406: U$1.1 22.39,53.81 22.86,53.34 41.38,53.34 42.69,54.65 42.69,55.66 U$1.17
VDD
  Top 0.406: 24.05,62.04 arc45 23.86,61.97 | 22.39,60.38 arc-45 22.46,60.56 | C12.2 38.33,40.51 arc-45 38.15,40.59 38.1,40.64
  Top 0.508: C10.2 15.52,15.27 15.49,15.24 | 35.7,62.04 36.36,61.38 36.36,53.19 38.1,51.45 38.1,40.64 38.1,34.29 36.2,32.38 | 36.2,32.38 34.29,30.48 32.75,30.48 OK1.8 32.51,30.24 | R3.2 35.99,32.59 36.2,32.38
  Top 0.61: U3.3 16,20.95 16,21.34 | 16,21.34 16,23.11 23.88,23.11 24.64,23.88 24.64,24.89 26.16,26.42 31.5,26.42 32.51,27.43 32.51,30.24 | U4.3 16.13,10.79 15.49,11.43 15.49,15.24 15.49,17.02 14.99,17.53 14.99,20.32 16,21.34 | 35.7,62.04 24.05,62.04 | U$1.2 22.39,60.38 | 22.46,60.56 23.86,61.97

### Text on the board
tNames: RS485_GND | RS485_VBUS | RS485_B | RS485_A | RS485_GND | RS485_5V | CAN_GND | CAN_VBUS | CAN0_L | CAN0_H | CAN_GND | CAN_VBUS | CAN1_L | CAN1_H | CAN_GND | CAN_VBUS